# Altium schematic sheet battery pack.SchDoc
size A4
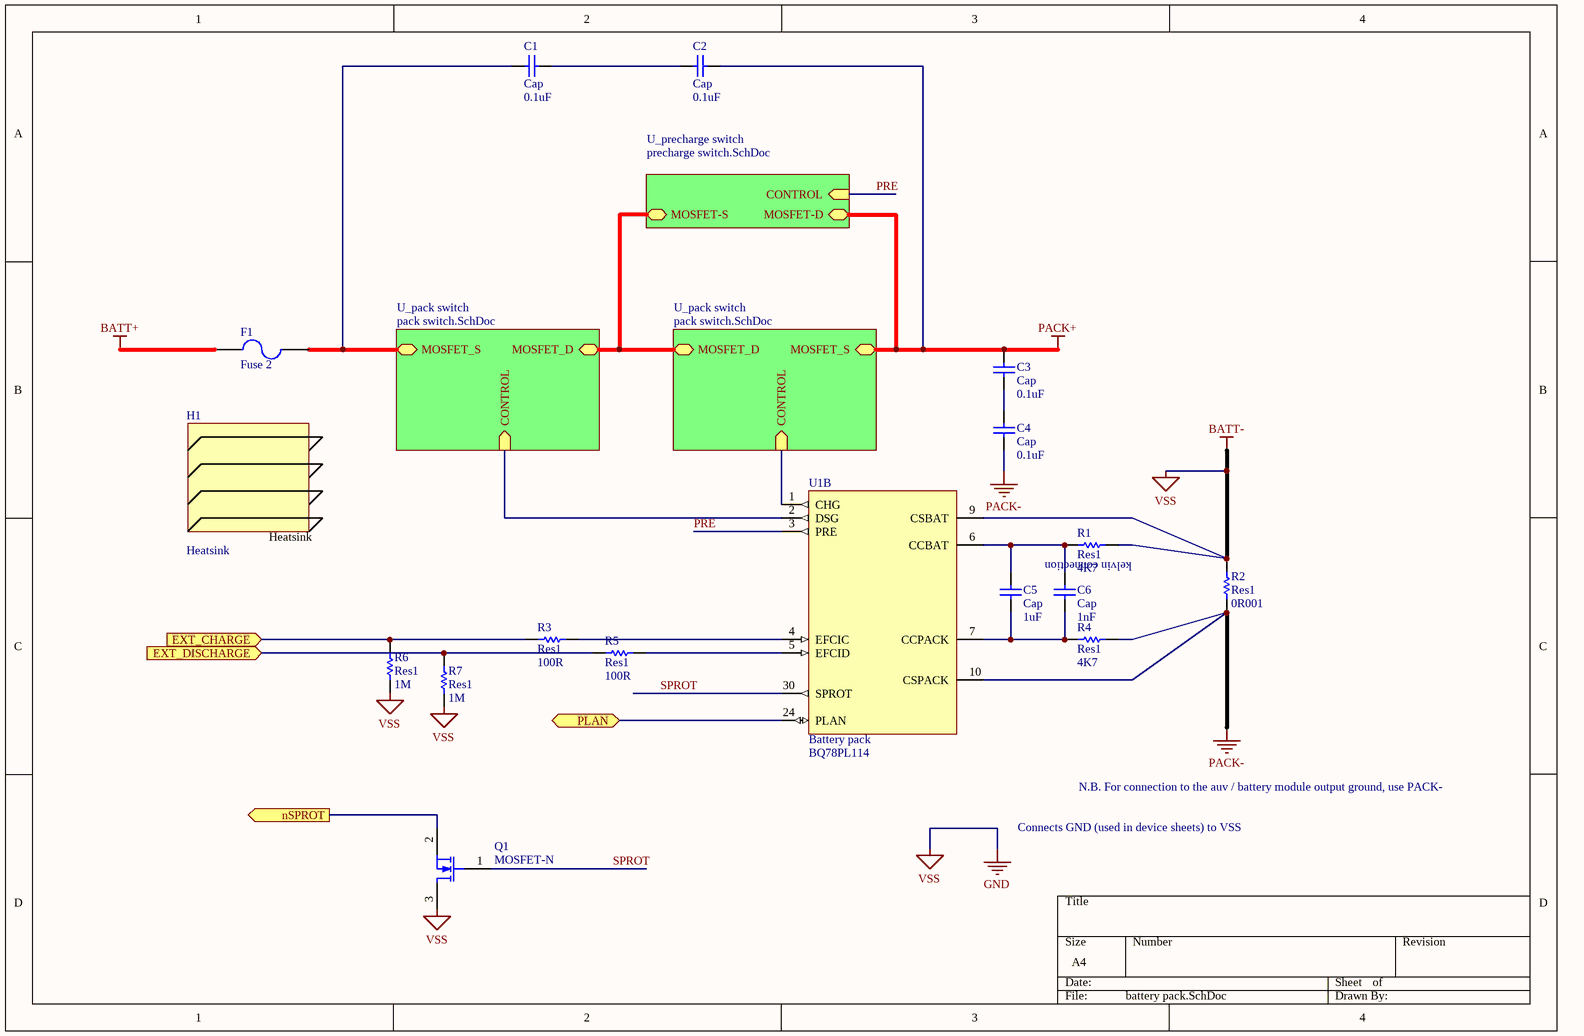
[diagram p0: battery pack.SchDoc]

## Parts
C1  Cap  value 0.1uF  [C0805]
C2  Cap  value 0.1uF  [C0805]
C3  Cap  value 0.1uF  [C0805]
C4  Cap  value 0.1uF  [C0805]
C5  Cap  value 1uF  [C0805]
C6  Cap  value 1nF  [C0805]
F1  Fuse 2  [FUSE outline]
H1  Heatsink
Q1  MOSFET-N  [2N7002]
R1  Res1  value 4K7  [R0603]
R2  Res1  value 0R001  [BCS80R001F]
R3  Res1  value 100R  [R0603]
R4  Res1  value 4K7  [R0603]
R5  Res1  value 100R  [R0603]
R6  Res1  value 1M  [R0603]
R7  Res1  value 1M  [R0603]
U1  BQ78PL114  [QFN50P700X700X100-48N]  (part B of 3)

## Sub-sheets
U_pack switch = pack switch.SchDoc: MOSFET_S (bidir), MOSFET_D (bidir), CONTROL (in)
U_pack switch = pack switch.SchDoc: MOSFET_S (bidir), MOSFET_D (bidir), CONTROL (in)
U_precharge switch = precharge switch.SchDoc: MOSFET-D (bidir), MOSFET-S (bidir), CONTROL (in)

## Ports
EXT_CHARGE (in), EXT_DISCHARGE (in), nSPROT (out), PLAN (bidir)

## Nets
BATT+: F1.2
BATT-: Q1.3(D) R1.2 R2.2 R6.2 R7.2 U1.9(CSBAT)  [also labelled GND, VSS]
PACK+: C2.2 C3.2 ; sheet U_pack switch/MOSFET_S, sheet U_precharge switch/MOSFET-D
PACK-: C4.1 R2.1 R4.2 U1.10(CSPACK)
EXT_CHARGE: R3.1 R6.1 ; port EXT_CHARGE
EXT_DISCHARGE: R5.1 R7.1 ; port EXT_DISCHARGE
nSPROT: Q1.2(S) ; port nSPROT
PLAN: U1.24(PLAN) ; port PLAN
PRE: U1.3(PRE) ; sheet U_precharge switch/CONTROL
SPROT: Q1.1(G) U1.30(SPROT)
NetC1_1: C1.1 F1.1 ; sheet U_pack switch/MOSFET_S
NetC1_2: C1.2 C2.1
NetC3_1: C3.1 C4.2
NetC5_1: C5.1 C6.1 R4.1 U1.7(CCPACK)
NetC5_2: C5.2 C6.2 R1.1 U1.6(CCBAT)
NetR3_2: R3.2 U1.4(EFCIC)
NetR5_2: R5.2 U1.5(EFCID)
NetU1_1: U1.1(CHG) ; sheet U_pack switch/CONTROL
NetU1_2: U1.2(DSG) ; sheet U_pack switch/CONTROL
(unnamed): sheet U_pack switch/MOSFET_D, sheet U_pack switch/MOSFET_D, sheet U_precharge switch/MOSFET-S

## Notes on the sheet
- (near R2) kelvin connection
- N.B. For connection to the auv / battery module output ground, use PACK-
- Connects GND (used in device sheets) to VSS
- (in symbol BQ78PL114, part B) Battery pack

## Library data of the parts
C1-C6 = Cap: Capacitor; Published: 8-Jun-2000; LatestRevisionDate: 17-Jul-2002; LatestRevisionNote: Re-released for DXP Platform.; PackageReference: RAD-0.3; Publisher: Altium Limited
  C1-C4: farnell: 1414664
  C5: farnell: 1759432
  C6: farnell: 1520296
F1 = Fuse 2: Fuse; Published: 8-Jun-2000; LatestRevisionDate: 17-Jul-2002; LatestRevisionNote: Re-released for DXP Platform.; PackageReference: PIN-W2/E2.8; Publisher: Altium Limited; mouser: 534-3550-2
Q1 = 2N7002: NXP - 2N7002 - MOSFET,N CH, 60V,0.3A,SOT23; farnell: 1510761
R1 R3-R7 = Res1: Resistor; Published: 8-Jun-2000; LatestRevisionDate: 17-Jul-2002; LatestRevisionNote: Re-released for DXP Platform.; PackageReference: AXIAL-0.3; Publisher: Altium Limited
  R1 R4: farnell: 9331247
  R3 R5: farnell: 9330364
  R6 R7: farnell: 9330410
R2 = Res1: BI TECHNOLOGIES BCS80R001F; Published: 8-Jun-2000; LatestRevisionDate: 17-Jul-2002; LatestRevisionNote: Re-released for DXP Platform.; PackageReference: AXIAL-0.3; Publisher: Altium Limited; farnell: 1114443
U1 = BQ78PL114: IC, BATT MANAGEMENT CONTRL, 48QFN; farnell: 1684746; digikey: 296-23814-1-ND
H1 = Heatsink: farnell: 4302254